# Altium project higgs.PrjPCB (part 6 of 7)

## Sheet cellular.SchDoc
size D; CompanyName: Signal Laboratories, Inc.; Address1: 3479 Edison Way; Address2: Menlo Park CA 94025; Address3: +1 (877) 778-8435; Address4: siglabs.com; Revision: 1; SheetNumber: 1; SheetTotal: 1
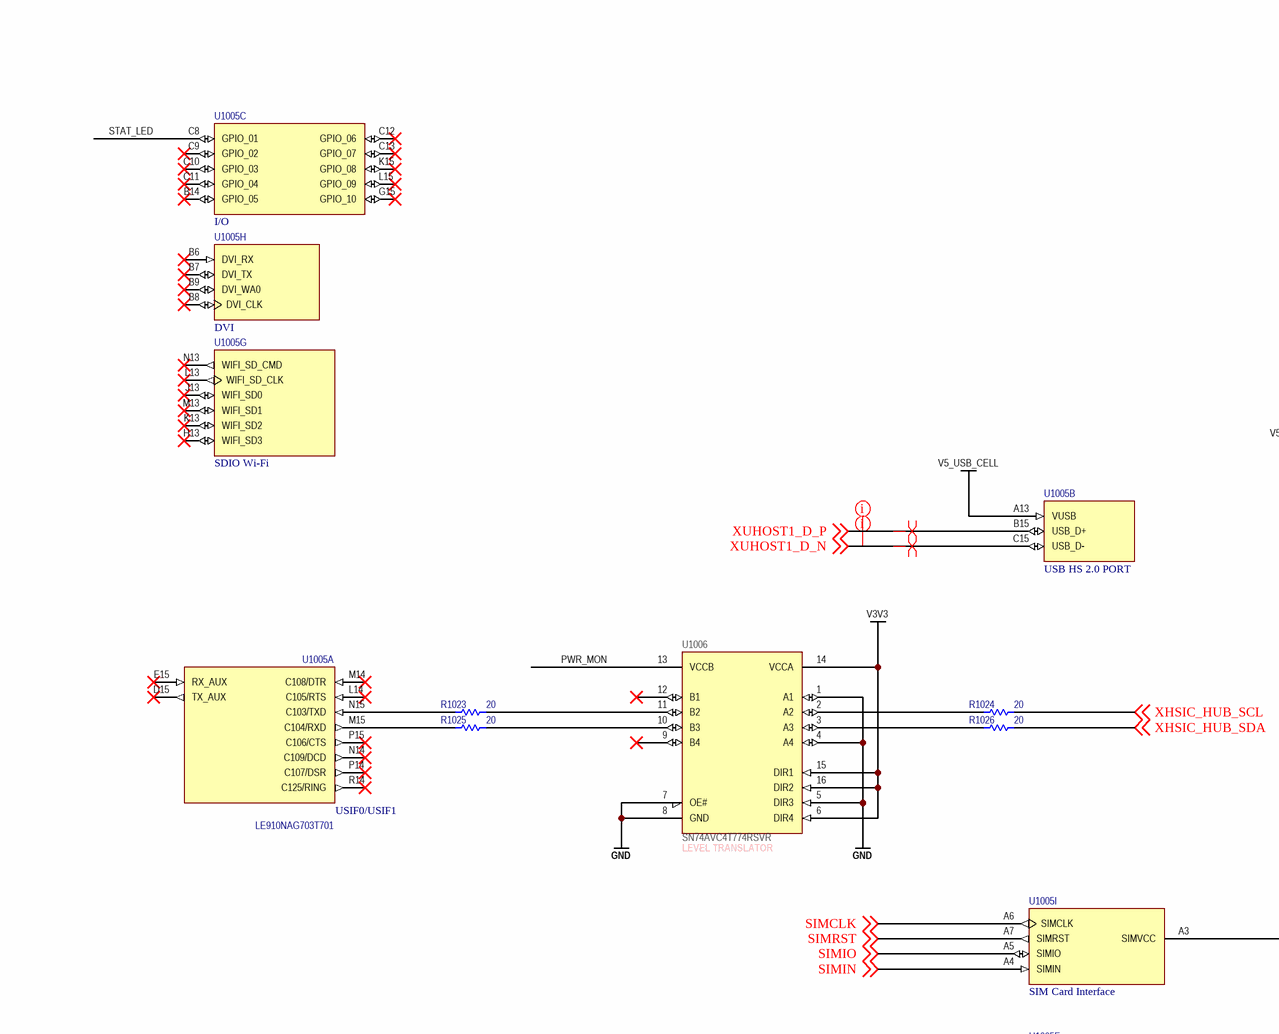
[diagram p36: cellular.SchDoc, top left]
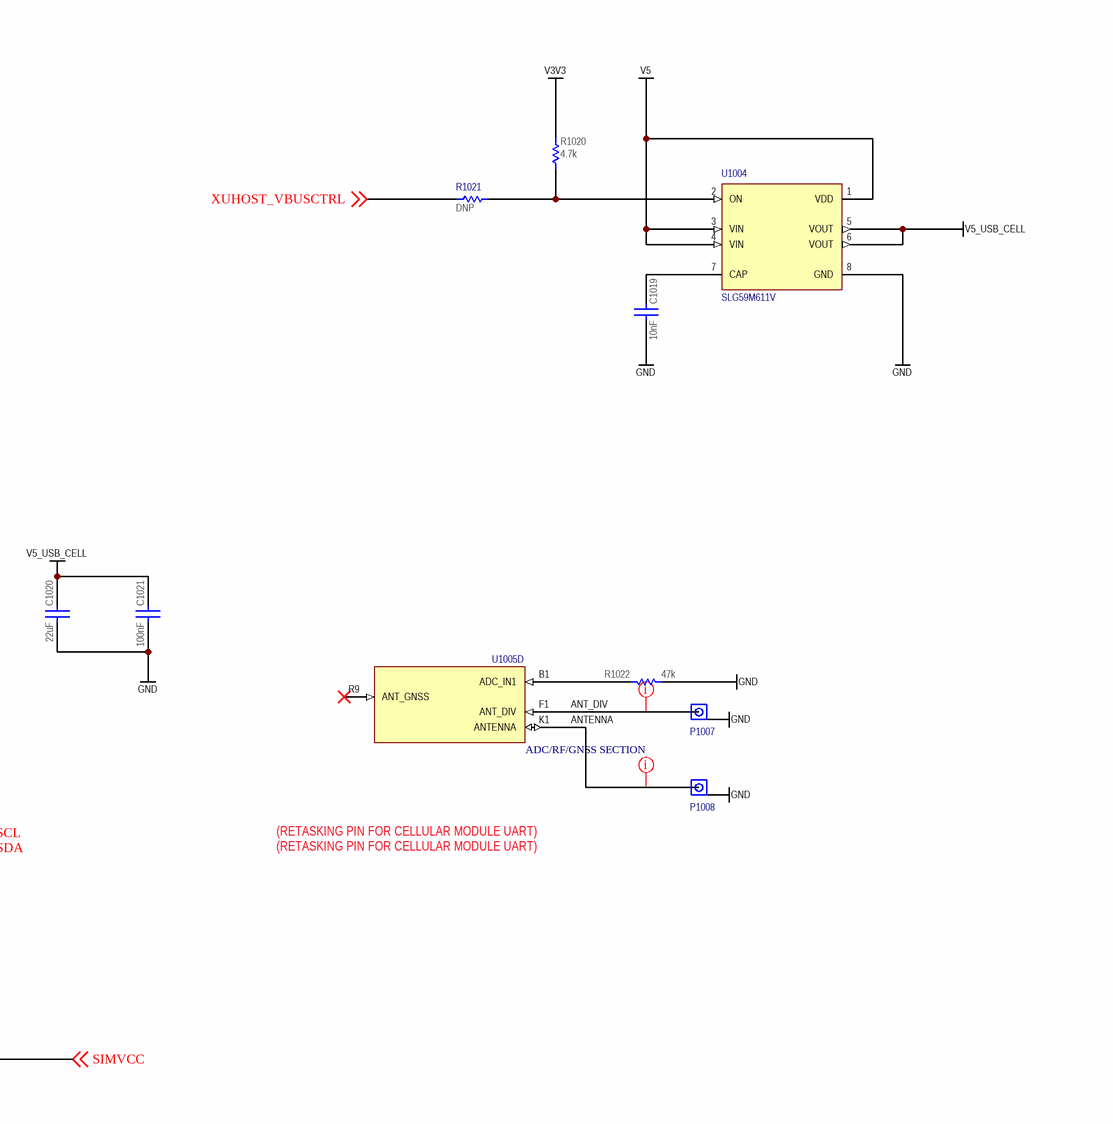
[diagram p37: cellular.SchDoc, top right]
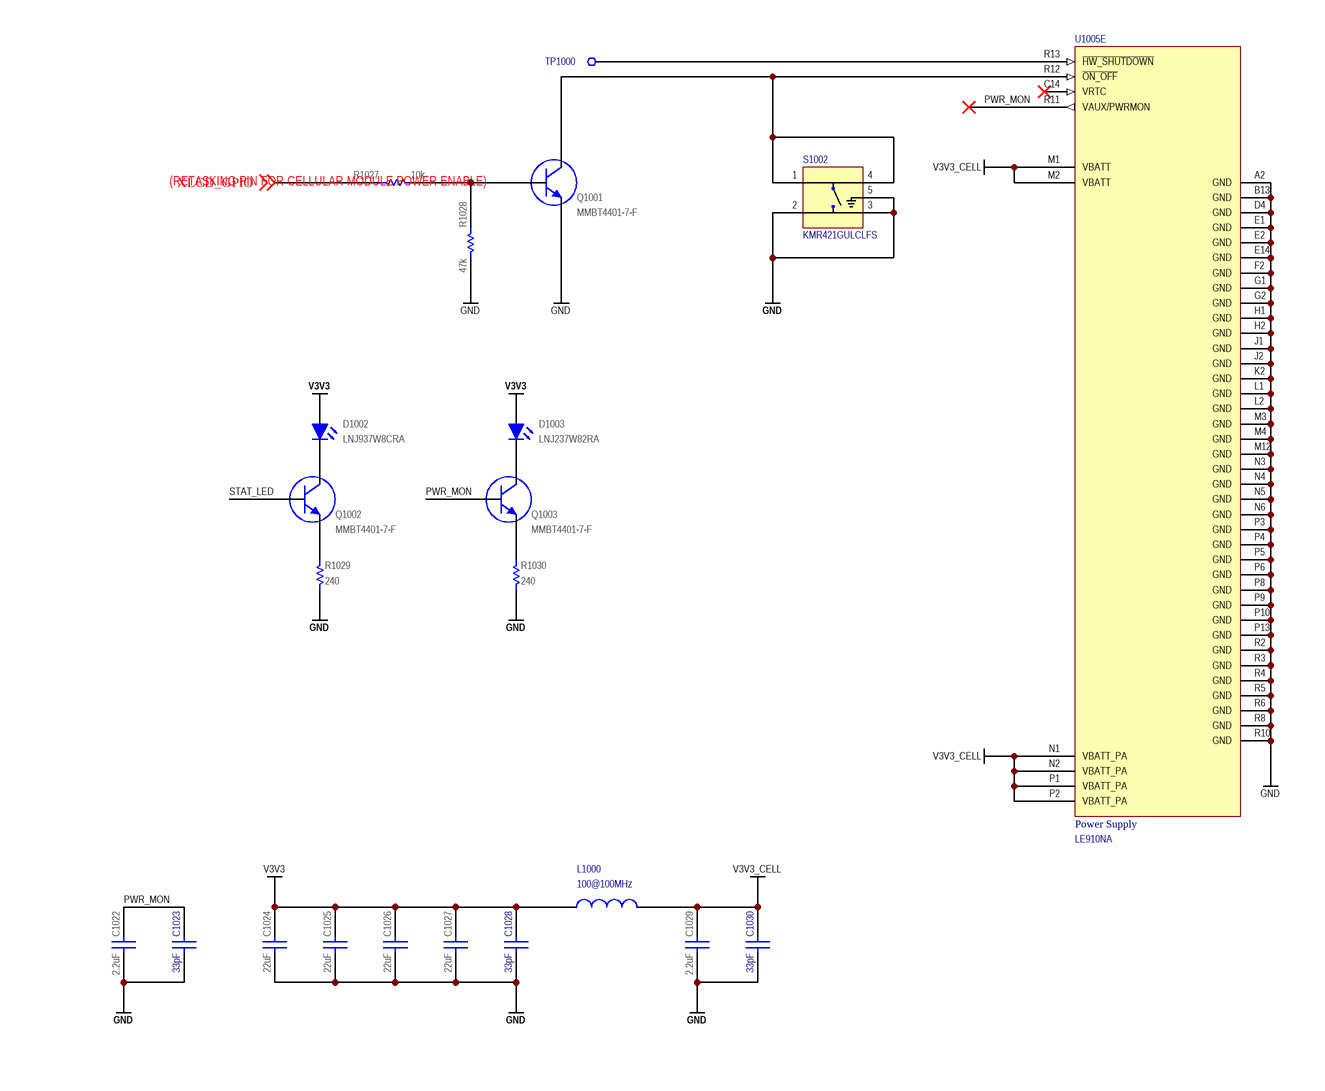
[diagram p38: cellular.SchDoc, bottom left]
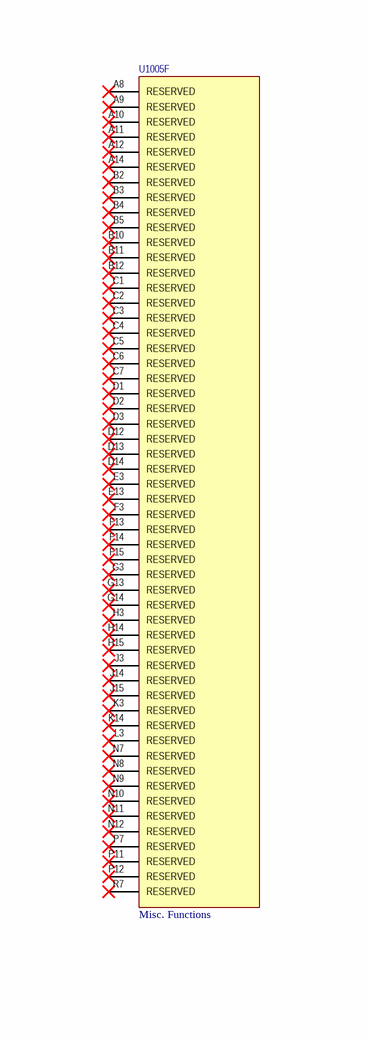
[diagram p39: cellular.SchDoc, bottom right]

### Parts
C1019  value 10nF  [CAPC100X50X55L25N]  (hidden comment: GCM155R71H103KA55)
C1020  value 22uF  [CAPC200X125X145L45N]  (hidden comment: C2012X7S1A226M125)
C1021  value 100nF  [CAPC100X50X55L25N]  (hidden comment: GCM155R71H104KE02)
C1022  value 2.2uF  [CAPC160X80X90L20N]  (hidden comment: C1608X7R1A225M080)
C1023  value 33pF  [0402]  (hidden comment: CBR04C330F5GAC)
C1024  value 22uF  [CAPC200X125X145L45N]  (hidden comment: C2012X7S1A226M125)
C1025  value 22uF  [CAPC200X125X145L45N]  (hidden comment: C2012X7S1A226M125)
C1026  value 22uF  [CAPC200X125X145L45N]  (hidden comment: C2012X7S1A226M125)
C1027  value 22uF  [CAPC200X125X145L45N]  (hidden comment: C2012X7S1A226M125)
C1028  value 33pF  [0402]  (hidden comment: CBR04C330F5GAC)
C1029  value 2.2uF  [CAPC160X80X90L20N]  (hidden comment: C1608X7R1A225M080)
C1030  value 33pF  [0402]  (hidden comment: CBR04C330F5GAC)
D1002  LNJ937W8CRA  [0603_LED]
D1003  LNJ237W82RA  [0603_LED]
L1000  value 100@100MHz  [0603]  (hidden comment: BLM15PX601SN1D)
P1007  U.FL-R-SMT(10)  [U.FL-R-SMT(10)]  (value not drawn)
P1008  U.FL-R-SMT(10)  [U.FL-R-SMT(10)]  (value not drawn)
Q1001  MMBT4401-7-F  [SOT23]
Q1002  MMBT4401-7-F  [SOT23]
Q1003  MMBT4401-7-F  [SOT23]
R1020  value 4.7k  [RESC1005X40N]  (hidden comment: ERJ-2RKF4701X)
R1021  Do Not Place: DNP  [0402]  (hidden comment: ERJ-2RKF20R0X)
R1022  value 47k  [RESC1005X40N]  (hidden comment: ERJ-2RKF4702X)
R1023  value 20  [0402]  (hidden comment: ERJ-2RKF20R0X)
R1024  value 20  [0402]  (hidden comment: ERJ-2RKF20R0X)
R1025  value 20  [0402]  (hidden comment: ERJ-2RKF20R0X)
R1026  value 20  [0402]  (hidden comment: ERJ-2RKF20R0X)
R1027  value 10k  [RESC1005X40N]  (hidden comment: ERJ-2RKF1002X)
R1028  value 47k  [RESC1005X40N]  (hidden comment: ERJ-2RKF4702X)
R1029  value 240  [RESC1005X40N]  (hidden comment: ERJ-2RKF2400X)
R1030  value 240  [RESC1005X40N]  (hidden comment: ERJ-2RKF2400X)
S1002  KMR421GULCLFS  [SW_KMR421GULCLFS]
TP1000  TEST_POINT_SMD_10  [TEST_POINT_SMD_10]  (value not drawn)  (no BOM)
U1004  SLG59M611V  [DFN200X150X80-8N]
U1005  LE910NAG703T701  [LGA144S180P15X15_2820X2820X225_LE910NAG703T701(Primary)]  (parts A,B,C,D,E,F,G,H,I of 9)
U1006  SN74AVC4T774RSVR  [RSV]

### Nets
GND: C1019.1 C1020.1 C1021.1 C1022.1 C1023.2 C1024.1 C1025.1 C1026.1 C1027.1 C1028.2 C1029.1 C1030.2 P1007.2(GND) P1008.2(GND) Q1001.2(E) R1022.1 R1028.1 R1029.2 R1030.2 S1002.2 S1002.3 S1002.5(G) U1004.8(GND) U1005.A2(GND) U1005.B13(GND) U1005.D4(GND) U1005.E1(GND) U1005.E2(GND) U1005.E14(GND) U1005.F2(GND) U1005.G1(GND) U1005.G2(GND) U1005.H1(GND) U1005.H2(GND) U1005.J1(GND) U1005.J2(GND) U1005.K2(GND) U1005.L1(GND) U1005.L2(GND) U1005.M3(GND) U1005.M4(GND) U1005.M12(GND) U1005.N3(GND) U1005.N4(GND) U1005.N5(GND) U1005.N6(GND) U1005.P3(GND) U1005.P4(GND) U1005.P5(GND) U1005.P6(GND) U1005.P8(GND) U1005.P9(GND) U1005.P10(GND) U1005.P13(GND) U1005.R2(GND) U1005.R3(GND) U1005.R4(GND) U1005.R5(GND) U1005.R6(GND) U1005.R8(GND) U1005.R10(GND) U1006.1(A1) U1006.4(A4) U1006.5(DIR3) U1006.7(OE#) U1006.8(GND)
V3V3: C1024.2 C1025.2 C1026.2 C1027.2 C1028.1 D1002.1(A) D1003.1(A) L1000.1 R1020.2 U1006.6(DIR4) U1006.14(VCCA) U1006.15(DIR1) U1006.16(DIR2)
V3V3_CELL: C1029.2 C1030.1 L1000.2 U1005.M1(VBATT) U1005.M2(VBATT) U1005.N1(VBATT_PA) U1005.N2(VBATT_PA) U1005.P1(VBATT_PA) U1005.P2(VBATT_PA)
V5: U1004.1(VDD) U1004.3(VIN) U1004.4(VIN)
V5_USB_CELL: C1020.2 C1021.2 U1004.5(VOUT) U1004.6(VOUT) U1005.A13(VUSB)
ANT_DIV: P1007.1(RF) U1005.F1(ANT_DIV)
ANTENNA: P1008.1(RF) U1005.K1(ANTENNA)
PWR_MON: C1022.2 C1023.1 Q1003.1(B) U1005.R11(VAUX/PWRMON) U1006.13(VCCB)
SIMCLK: U1005.A6(SIMCLK) ; off-sheet SIMCLK
SIMIN: U1005.A4(SIMIN) ; off-sheet SIMIN
SIMIO: U1005.A5(SIMIO) ; off-sheet SIMIO
SIMRST: U1005.A7(SIMRST) ; off-sheet SIMRST
SIMVCC: U1005.A3(SIMVCC) ; off-sheet SIMVCC
STAT_LED: Q1002.1(B) U1005.C8(GPIO_01)
XHSIC_HUB_SCL: R1024.1 ; off-sheet XHSIC_HUB_SCL
XHSIC_HUB_SDA: R1026.1 ; off-sheet XHSIC_HUB_SDA
XLCD_GPIO: R1027.2 ; off-sheet XLCD_GPIO
XUHOST1_D_N: U1005.C15(USB_D-) ; off-sheet XUHOST1_D_N
XUHOST1_D_P: U1005.B15(USB_D+) ; off-sheet XUHOST1_D_P
XUHOST_VBUSCTRL: R1021.2 ; off-sheet XUHOST_VBUSCTRL
NetC1019_2: C1019.2 U1004.7(CAP)
NetD1002_2: D1002.2(K) Q1002.3(C)
NetD1003_2: D1003.2(K) Q1003.3(C)
NetQ1001_1: Q1001.1(B) R1027.1 R1028.2
NetQ1001_3: Q1001.3(C) S1002.1 S1002.4 U1005.R12(~{ON_OFF})
NetQ1002_2: Q1002.2(E) R1029.1
NetQ1003_2: Q1003.2(E) R1030.1
NetR1020_1: R1020.1 R1021.1 U1004.2(ON)
NetR1022_2: R1022.2 U1005.B1(ADC_IN1)
NetR1023_1: R1023.1 U1006.11(B2)
NetR1023_2: R1023.2 U1005.N15(C103/TXD)
NetR1024_2: R1024.2 U1006.2(A2)
NetR1025_1: R1025.1 U1006.10(B3)
NetR1025_2: R1025.2 U1005.M15(C104/RXD)
NetR1026_2: R1026.2 U1006.3(A3)
NetTP1000_1: TP1000.1 U1005.R13(~{HW_SHUTDOWN})

Not connected (* = marked no-connect by the designer): U1005 A8(RESERVED)* A9(RESERVED)* A10(RESERVED)* A11(RESERVED)* A12(RESERVED)* A14(RESERVED)* B2(RESERVED)* B3(RESERVED)* B4(RESERVED)* B5(RESERVED)* B6(DVI_RX)* B7(DVI_TX)* B8(DVI_CLK)* B9(DVI_WA0)* B10(RESERVED)* B11(RESERVED)* B12(RESERVED)* B14(GPIO_05)* C1(RESERVED)* C2(RESERVED)* C3(RESERVED)* C4(RESERVED)* C5(RESERVED)* C6(RESERVED)* C7(RESERVED)* C9(GPIO_02)* C10(GPIO_03)* C11(GPIO_04)* C12(GPIO_06)* C13(GPIO_07)* C14(VRTC)* D1(RESERVED)* D2(RESERVED)* D3(RESERVED)* D12(RESERVED)* D13(RESERVED)* D14(RESERVED)* D15(TX_AUX)* E3(RESERVED)* E13(RESERVED)* E15(RX_AUX)* F3(RESERVED)* F13(RESERVED)* F14(RESERVED)* F15(RESERVED)* G3(RESERVED)* G13(RESERVED)* G14(RESERVED)* G15(GPIO_10)* H3(RESERVED)* H13(WIFI_SD3)* H14(RESERVED)* H15(RESERVED)* J3(RESERVED)* J13(WIFI_SD0)* J14(RESERVED)* J15(RESERVED)* K3(RESERVED)* K13(WIFI_SD2)* K14(RESERVED)* K15(GPIO_08)* L3(RESERVED)* L13(WIFI_SD_CLK)* L14(C105/RTS)* L15(GPIO_09)* M13(WIFI_SD1)* M14(C108/DTR)* N7(RESERVED)* N8(RESERVED)* N9(RESERVED)* N10(RESERVED)* N11(RESERVED)* N12(RESERVED)* N13(WIFI_SD_CMD)* N14(C109/DCD)* P7(RESERVED)* P11(RESERVED)* P12(RESERVED)* P14(C107/DSR)* P15(C106/CTS)* R7(RESERVED)* R9(ANT_GNSS)* R14(C125/RING)*; U1006 9(B4)* 12(B1)*

### Layout directives
net class RF: ANT_DIV, ANTENNA
net class USB: XUHOST1_D_N, XUHOST1_D_P
differential pair: XUHOST1_D_N, XUHOST1_D_P

### Notes on the sheet
- (RETASKING PIN FOR CELLULAR MODULE UART)
- (near U1006) LEVEL TRANSLATOR
- (RETASKING PIN FOR CELLULAR MODULE POWER ENABLE)
- Title
- Engineer
- Revision
- Drawn By
- Sheet
- of
- Checked By
- Date
- (in symbol LE910NAG703T701, part A) USIF0/USIF1
- (in symbol LE910NAG703T701, part B) USB HS 2.0 PORT
- (in symbol LE910NAG703T701, part C) I/O
- (in symbol LE910NAG703T701, part D) ADC/RF/GNSS SECTION
- (in symbol LE910NAG703T701, part E) Power Supply
- (in symbol LE910NAG703T701, part F) Misc. Functions
- (in symbol LE910NAG703T701, part G) SDIO Wi-Fi
- (in symbol LE910NAG703T701, part H) DVI
- (in symbol LE910NAG703T701, part I) SIM Card Interface

### Library data of the parts
C1019 = CAP: Ceramic Capacitor 10nF ±10% 50V X7R 0402; Manufacturer: Murata; Tr: -55:125; Manufacturer P/N: GCM155R71H103KA55; Tolerance: ±10%; Voltage: 50V; Footprint: *; Package: 0402
C1020 C1024-C1027 = CAP: Ceramic Capacitor 22uF ±20% 10V X7S 0805; Manufacturer: TDK; Tr: -55:125; Manufacturer P/N: C2012X7S1A226M125; Tolerance: ±20%; Voltage: 10V; Package: 0805
C1021 = CAP: Ceramic Capacitor 100nF ±10% 50V X7R 0402; Manufacturer: Murata; Tr: -55:125; Manufacturer P/N: GCM155R71H104KE02; Tolerance: ±10%; Voltage: 50V; Footprint: *; Package: 0402
C1022 C1029 = CAP: Ceramic Capacitor 2.2uF ±20% 10V X7R 0603; Manufacturer: TDK; Tr: -55:125; Manufacturer P/N: C1608X7R1A225M080; Tolerance: ±20%; Voltage: 10V; Footprint: *; Package: 0603
C1023 C1028 C1030 = CAP 0603: Ceramic Capacitor 33pF ±1% 50V NP0 0402; Manufacturer: Kemet; Tr: -55:125; Voltage: 50V; Manufacturer P/N: CBR04C330F5GAC; Package: 0402; Do Not Place: *; Tolerance: ±1%
D1002 = LED0603GR: LED, SMT 0603, Color Blue, 5mA, 2.9V; Manufacturer: Panasonic; Manufacturer P/N: LNJ937W8CRA; Package: 0603 Polarized
D1003 = LED0603RD: LED, SMT 0603, Color Red, 5mA, 1.85V; Manufacturer: Panasonic; Manufacturer P/N: LNJ237W82RA; Package: 0603 Polarized
L1000 = IND 0402: Ferrite Bead 100-Ohm @ 100MHz 2A 0603; Manufacturer: Murata; Manufacturer P/N: BLM18EG101TN1; Tolerance: ±25%; Tr: -55:125; Package: 0603
P1007 P1008 = U.FL-R-SMT(10): Ultra Miniature Coaxial Jack, 50 Ohms; Manufacturer: Hirose; Manufacturer P/N: U.FL-R-SMT(10)
Q1001-Q1003 = MMBT4401-7-F: NPN Small Signal Transistor SMD SOT-23; Manufacturer: Diodes, Inc.; Manufacturer P/N: MMBT4401-7-F
R1020 = RES: Thick Film Resistor 4.7k ±1% 0.1W 75V 0402; Manufacturer: Panasonic; Tcr: ±100; Tr: -55:155; Voltage: 75; Power: 0.1; Tolerance: ±1%; Manufacturer P/N: ERJ-2RKF4701X; Alternatives: *; Footprint: *; Package: 0402
R1021 = RES 0402: Thick Film Resistor 20 ±1% 0402; Manufacturer: Panasonic; Manufacturer P/N: RC0402FR-0720L; Value: 20; Tr: -55:155; Package: 0402; Tolerance: ±1%
R1022 R1028 = RES: Thick Film Resistor 47k ±1% 0.1W 75V 0402; Manufacturer: Panasonic; Tcr: ±100; Tr: -55:155; Voltage: 75; Power: 0.1; Tolerance: ±1%; Manufacturer P/N: ERJ-2RKF4702X; Alternatives: *; Footprint: *; Package: 0402
R1023-R1026 = RES 0402: Thick Film Resistor 20 ±1% 0402; Manufacturer: Panasonic; Manufacturer P/N: RC0402FR-0720L; Tr: -55:155; Package: 0402; Tolerance: ±1%
R1027 = RES: Thick Film Resistor 10k ±1% 0.1W 0402; Manufacturer: Panasonic; Tcr: ±100; Tr: -55:155; Voltage: 75; Power: 0.1; Tolerance: ±1%; Manufacturer P/N: ERJ-2RKF1002X; Alternatives: *; Footprint: *; Package: 0402
R1029 R1030 = RES: Thick Film Resistor 240 ±1% 0.1W 75V 0402; Manufacturer: Panasonic; Tcr: ±100; Tr: -55:155; Voltage: 75; Power: 0.1; Tolerance: ±1%; Manufacturer P/N: ERJ-2RKF2400X; Alternatives: *; Footprint: *; Package: 0402
S1002 = KMR421GULCLFS: Switch Tactile N.O. SPST Round Button Gull Wing 0.05A 32VDC 1VA 200000Cycles 2N SMD Automotive T/R; Manufacturer: C&K Components; Availability: Good; Package: None; Manufacturer P/N: KMR421GULCLFS; Price: 0.29 USD; Value: *
TP1000 = TEST_POINT_SMD_10: Test Point SMD
U1004 = SLG59M611V: High-Side Load Switch; Manufacturer: Silego; Package: WFDFN-8 Silego; Manufacturer P/N: SLG59M611V
U1005 = LE910NAG703T701: Manufacturer: Telit; Manufacturer P/N: LE910NAG703T701
U1006 = SN74AVC4T774RSVR: 4-Bit Dual-Supply Bus Transceiver; Manufacturer: Texas Instruments; Manufacturer P/N: SN74AVC4T774RSVR

## Sheet radio.SchDoc
size Letter; CompanyName: Signal Laboratories, Inc.; Address1: 3479 Edison Way; Address2: Menlo Park CA 94025; Address3: +1 (877) 778-8435; Address4: siglabs.com; Revision: 1; SheetNumber: 1; SheetTotal: 1
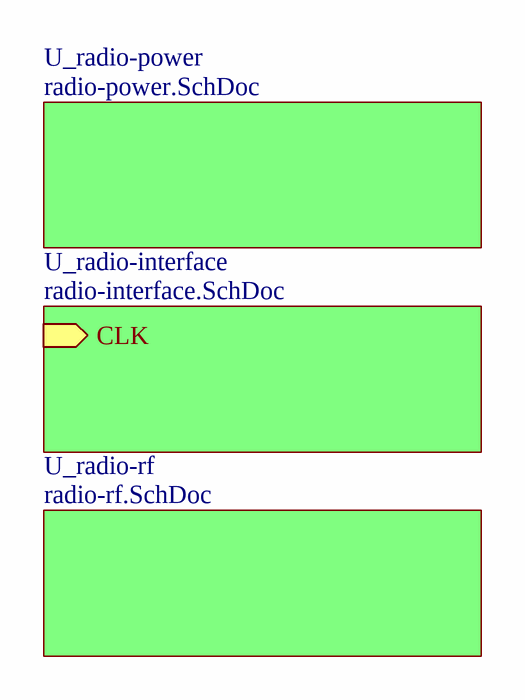
[diagram p40: radio.SchDoc]

### Sub-sheets
U_radio-interface = radio-interface.SchDoc: CLK (in)
U_radio-power = radio-power.SchDoc: no entries
U_radio-rf = radio-rf.SchDoc: no entries

### Notes on the sheet
- Title
- Engineer
- Revision
- Drawn By
- Checked By
- Date
- Sheet
- of

## Sheet radio-power.SchDoc
size Letter; CompanyName: Signal Laboratories, Inc.; Address1: 3479 Edison Way; Address2: Menlo Park CA 94025; Address3: +1 (877) 778-8435; Address4: siglabs.com; Revision: 1; SheetNumber: 1; SheetTotal: 1
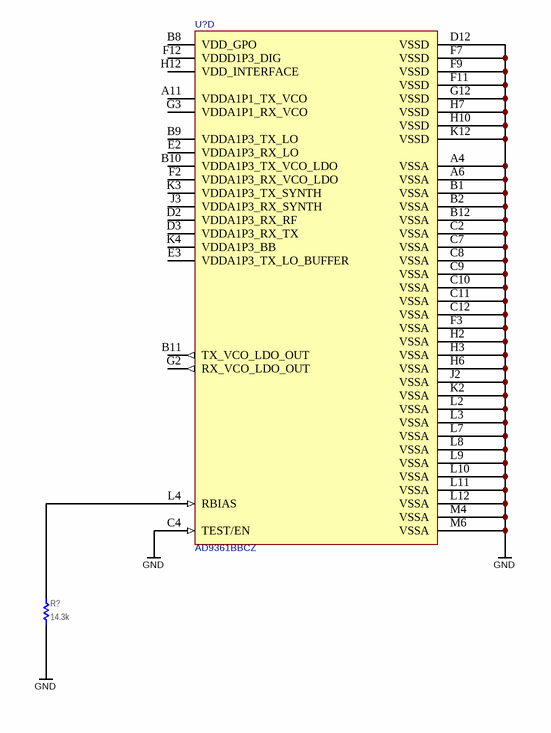
[diagram p41: radio-power.SchDoc]

### Parts
R?  value 14.3k  [RESC1005X40N]  (hidden comment: ERJ-2RKF1432X)
U?  AD9361BBCZ  [BGA144C80P12X12_1000X1000X170_AD9361BBCZ(Primary)]  (part D of 4)

### Nets
GND: R?.2 U?.A4(VSSA) U?.A6(VSSA) U?.B1(VSSA) U?.B2(VSSA) U?.B12(VSSA) U?.C2(VSSA) U?.C4(TEST/EN) U?.C7(VSSA) U?.C8(VSSA) U?.C9(VSSA) U?.C10(VSSA) U?.C11(VSSA) U?.C12(VSSA) U?.D12(VSSD) U?.F3(VSSA) U?.F7(VSSD) U?.F9(VSSD) U?.F11(VSSD) U?.G12(VSSD) U?.H2(VSSA) U?.H3(VSSA) U?.H6(VSSA) U?.H7(VSSD) U?.H10(VSSD) U?.J2(VSSA) U?.K2(VSSA) U?.K12(VSSD) U?.L2(VSSA) U?.L3(VSSA) U?.L7(VSSA) U?.L8(VSSA) U?.L9(VSSA) U?.L10(VSSA) U?.L11(VSSA) U?.L12(VSSA) U?.M4(VSSA) U?.M6(VSSA)
NetR?_1: R?.1 U?.L4(RBIAS)

Not connected (* = marked no-connect by the designer): U? A11(VDDA1P1_TX_VCO) B8(VDD_GPO) B9(VDDA1P3_TX_LO) B10(VDDA1P3_TX_VCO_LDO) B11(TX_VCO_LDO_OUT) D2(VDDA1P3_RX_RF) D3(VDDA1P3_RX_TX) E2(VDDA1P3_RX_LO) E3(VDDA1P3_TX_LO_BUFFER) F2(VDDA1P3_RX_VCO_LDO) F12(VDDD1P3_DIG) G2(RX_VCO_LDO_OUT) G3(VDDA1P1_RX_VCO) H12(VDD_INTERFACE) J3(VDDA1P3_RX_SYNTH) K3(VDDA1P3_TX_SYNTH) K4(VDDA1P3_BB)

### Notes on the sheet
- Title
- Engineer
- Revision
- Drawn By
- Checked By
- Date
- Sheet
- of

### Library data of the parts
R? = RES: Thick Film Resistor 14.3k ±1% 0.1W 75V 0402; Manufacturer: Panasonic; Tcr: ±100; Tr: -55:155; Voltage: 75; Power: 0.1; Tolerance: ±1%; Manufacturer P/N: ERJ-2RKF1432X; Alternatives: *; Footprint: *; Package: 0402
U? = AD9361: RF Agile Transceiver

## Sheet radio-interface.SchDoc
size Letter; CompanyName: Signal Laboratories, Inc.; Address1: 3479 Edison Way; Address2: Menlo Park CA 94025; Address3: +1 (877) 778-8435; Address4: siglabs.com; Revision: 1; SheetNumber: 1; SheetTotal: 1
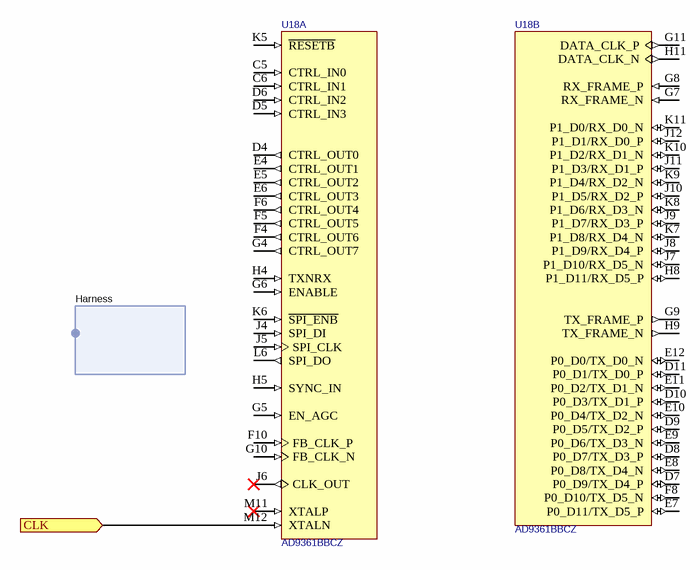
[diagram p42: radio-interface.SchDoc]

### Parts
U18  AD9361BBCZ  [BGA144C80P12X12_1000X1000X170_AD9361BBCZ(Primary)]  (parts A,B of 4)

### Ports
CLK (in)

### Harnesses
Harness: 

### Nets
CLK: U18.M12(XTALN) ; port CLK

Not connected (* = marked no-connect by the designer): U18 C5(CTRL_IN0) C6(CTRL_IN1) D4(CTRL_OUT0) D5(CTRL_IN3) D6(CTRL_IN2) D7(P0_D9/TX_D4_P) D8(P0_D7/TX_D3_P) D9(P0_D5/TX_D2_P) D10(P0_D3/TX_D1_P) D11(P0_D1/TX_D0_P) E4(CTRL_OUT1) E5(CTRL_OUT2) E6(CTRL_OUT3) E7(P0_D11/TX_D5_P) E8(P0_D8/TX_D4_N) E9(P0_D6/TX_D3_N) E10(P0_D4/TX_D2_N) E11(P0_D2/TX_D1_N) E12(P0_D0/TX_D0_N) F4(CTRL_OUT6) F5(CTRL_OUT5) F6(CTRL_OUT4) F8(P0_D10/TX_D5_N) F10(FB_CLK_P) G4(CTRL_OUT7) G5(EN_AGC) G6(ENABLE) G7(RX_FRAME_N) G8(RX_FRAME_P) G9(TX_FRAME_P) G10(FB_CLK_N) G11(DATA_CLK_P) H4(TXNRX) H5(SYNC_IN) H8(P1_D11/RX_D5_P) H9(TX_FRAME_N) H11(DATA_CLK_N) J4(SPI_DI) J5(SPI_CLK) J6(CLK_OUT)* J7(P1_D10/RX_D5_N) J8(P1_D9/RX_D4_P) J9(P1_D7/RX_D3_P) J10(P1_D5/RX_D2_P) J11(P1_D3/RX_D1_P) J12(P1_D1/RX_D0_P) K5(~{RESETB}) K6(~{SPI_ENB}) K7(P1_D8/RX_D4_N) K8(P1_D6/RX_D3_N) K9(P1_D4/RX_D2_N) K10(P1_D2/RX_D1_N) K11(P1_D0/RX_D0_N) L6(SPI_DO) M11(XTALP)*

### Notes on the sheet
- Title
- Engineer
- Revision
- Drawn By
- Checked By
- Date
- Sheet
- of

### Library data of the parts
U18 = AD9361: RF Agile Transceiver

## Sheet radio-rf.SchDoc
size Letter; CompanyName: Signal Laboratories, Inc.; Address1: 3479 Edison Way; Address2: Menlo Park CA 94025; Address3: +1 (877) 778-8435; Address4: siglabs.com; Revision: 1; SheetNumber: 1; SheetTotal: 1
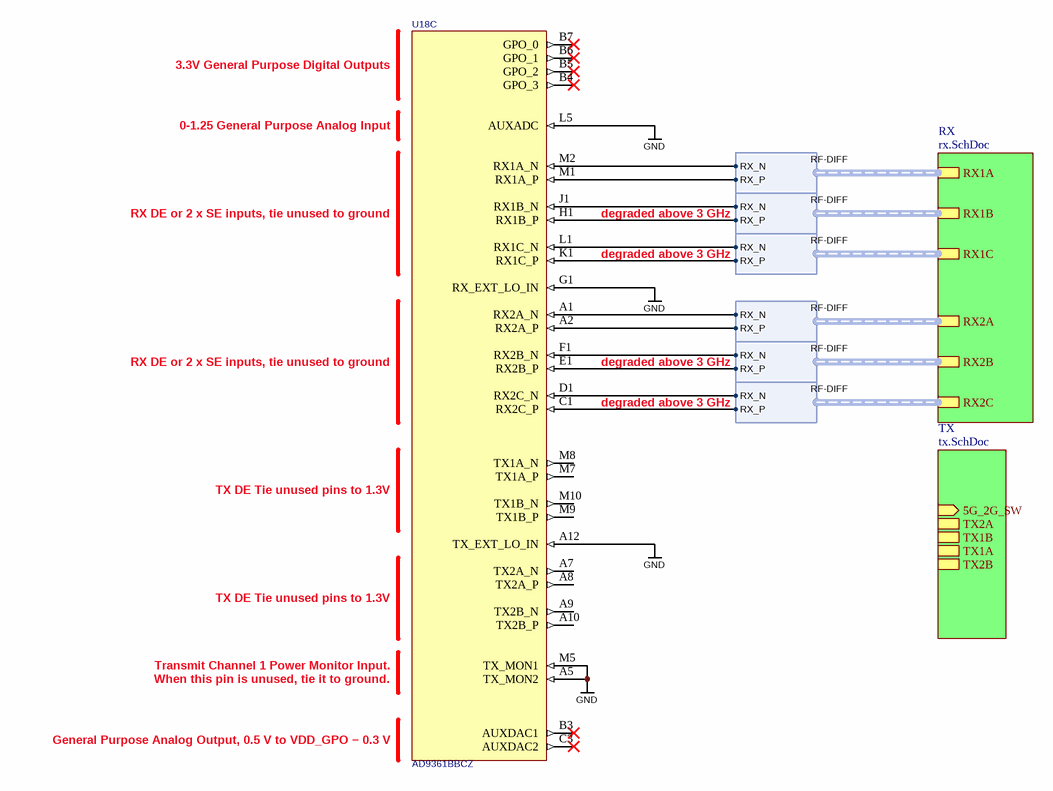
[diagram p43: radio-rf.SchDoc]

### Parts
U18  AD9361BBCZ  [BGA144C80P12X12_1000X1000X170_AD9361BBCZ(Primary)]  (part C of 4)

### Sub-sheets
RX = rx.SchDoc: RX1A (harness RF-DIFF), RX1B (harness RF-DIFF), RX1C (harness RF-DIFF), RX2A (harness RF-DIFF), RX2B (harness RF-DIFF), RX2C (harness RF-DIFF)
TX = tx.SchDoc: 5G_2G_SW (in), TX2A (harness RF-DIFF), TX1B (harness RF-DIFF), TX1A (harness RF-DIFF), TX2B (harness RF-DIFF)

### Harnesses
RF-DIFF: RX_N, RX_P

### Nets
GND: U18.A5(TX_MON2) U18.A12(TX_EXT_LO_IN) U18.G1(RX_EXT_LO_IN) U18.L5(AUXADC) U18.M5(TX_MON1)
NetC153_1: U18.M2(RX1A_N) ; sheet RX/RX1A.RX_N
NetC154_1: U18.M1(RX1A_P) ; sheet RX/RX1A.RX_P
NetC155_1: U18.J1(RX1B_N) ; sheet RX/RX1B.RX_N
NetC156_1: U18.H1(RX1B_P) ; sheet RX/RX1B.RX_P
NetC157_1: U18.L1(RX1C_N) ; sheet RX/RX1C.RX_N
NetC169_1: U18.K1(RX1C_P) ; sheet RX/RX1C.RX_P
NetC170_1: U18.A1(RX2A_N) ; sheet RX/RX2A.RX_N
NetC171_1: U18.A2(RX2A_P) ; sheet RX/RX2A.RX_P
NetC172_1: U18.F1(RX2B_N) ; sheet RX/RX2B.RX_N
NetC173_1: U18.E1(RX2B_P) ; sheet RX/RX2B.RX_P
NetC174_1: U18.D1(RX2C_N) ; sheet RX/RX2C.RX_N
NetC175_1: U18.C1(RX2C_P) ; sheet RX/RX2C.RX_P

Not connected (* = marked no-connect by the designer): U18 A7(TX2A_N) A8(TX2A_P) A9(TX2B_N) A10(TX2B_P) B3(AUXDAC1)* B4(GPO_3)* B5(GPO_2)* B6(GPO_1)* B7(GPO_0)* C3(AUXDAC2)* M7(TX1A_P) M8(TX1A_N) M9(TX1B_P) M10(TX1B_N)

### Notes on the sheet
- 3.3V General Purpose Digital Outputs
- 0-1.25 General Purpose Analog Input
- RX DE or 2 x SE inputs, tie unused to ground
- degraded above 3 GHz
- TX DE Tie unused pins to 1.3V
- Transmit Channel 1 Power Monitor Input.
- General Purpose Analog Output, 0.5 V to VDD_GPO − 0.3 V
- When this pin is unused, tie it to ground.
- Title
- Engineer
- Revision
- Drawn By
- Checked By
- Date
- Sheet
- of

### Library data of the parts
U18 = AD9361: RF Agile Transceiver

## Sheet tx.SchDoc
size Legal; CompanyName: Signal Laboratories, Inc.; Address1: 3479 Edison Way; Address2: Menlo Park CA 94025; Address3: +1 (877) 778-8435; Address4: siglabs.com; Revision: 1; SheetNumber: 1; SheetTotal: 1
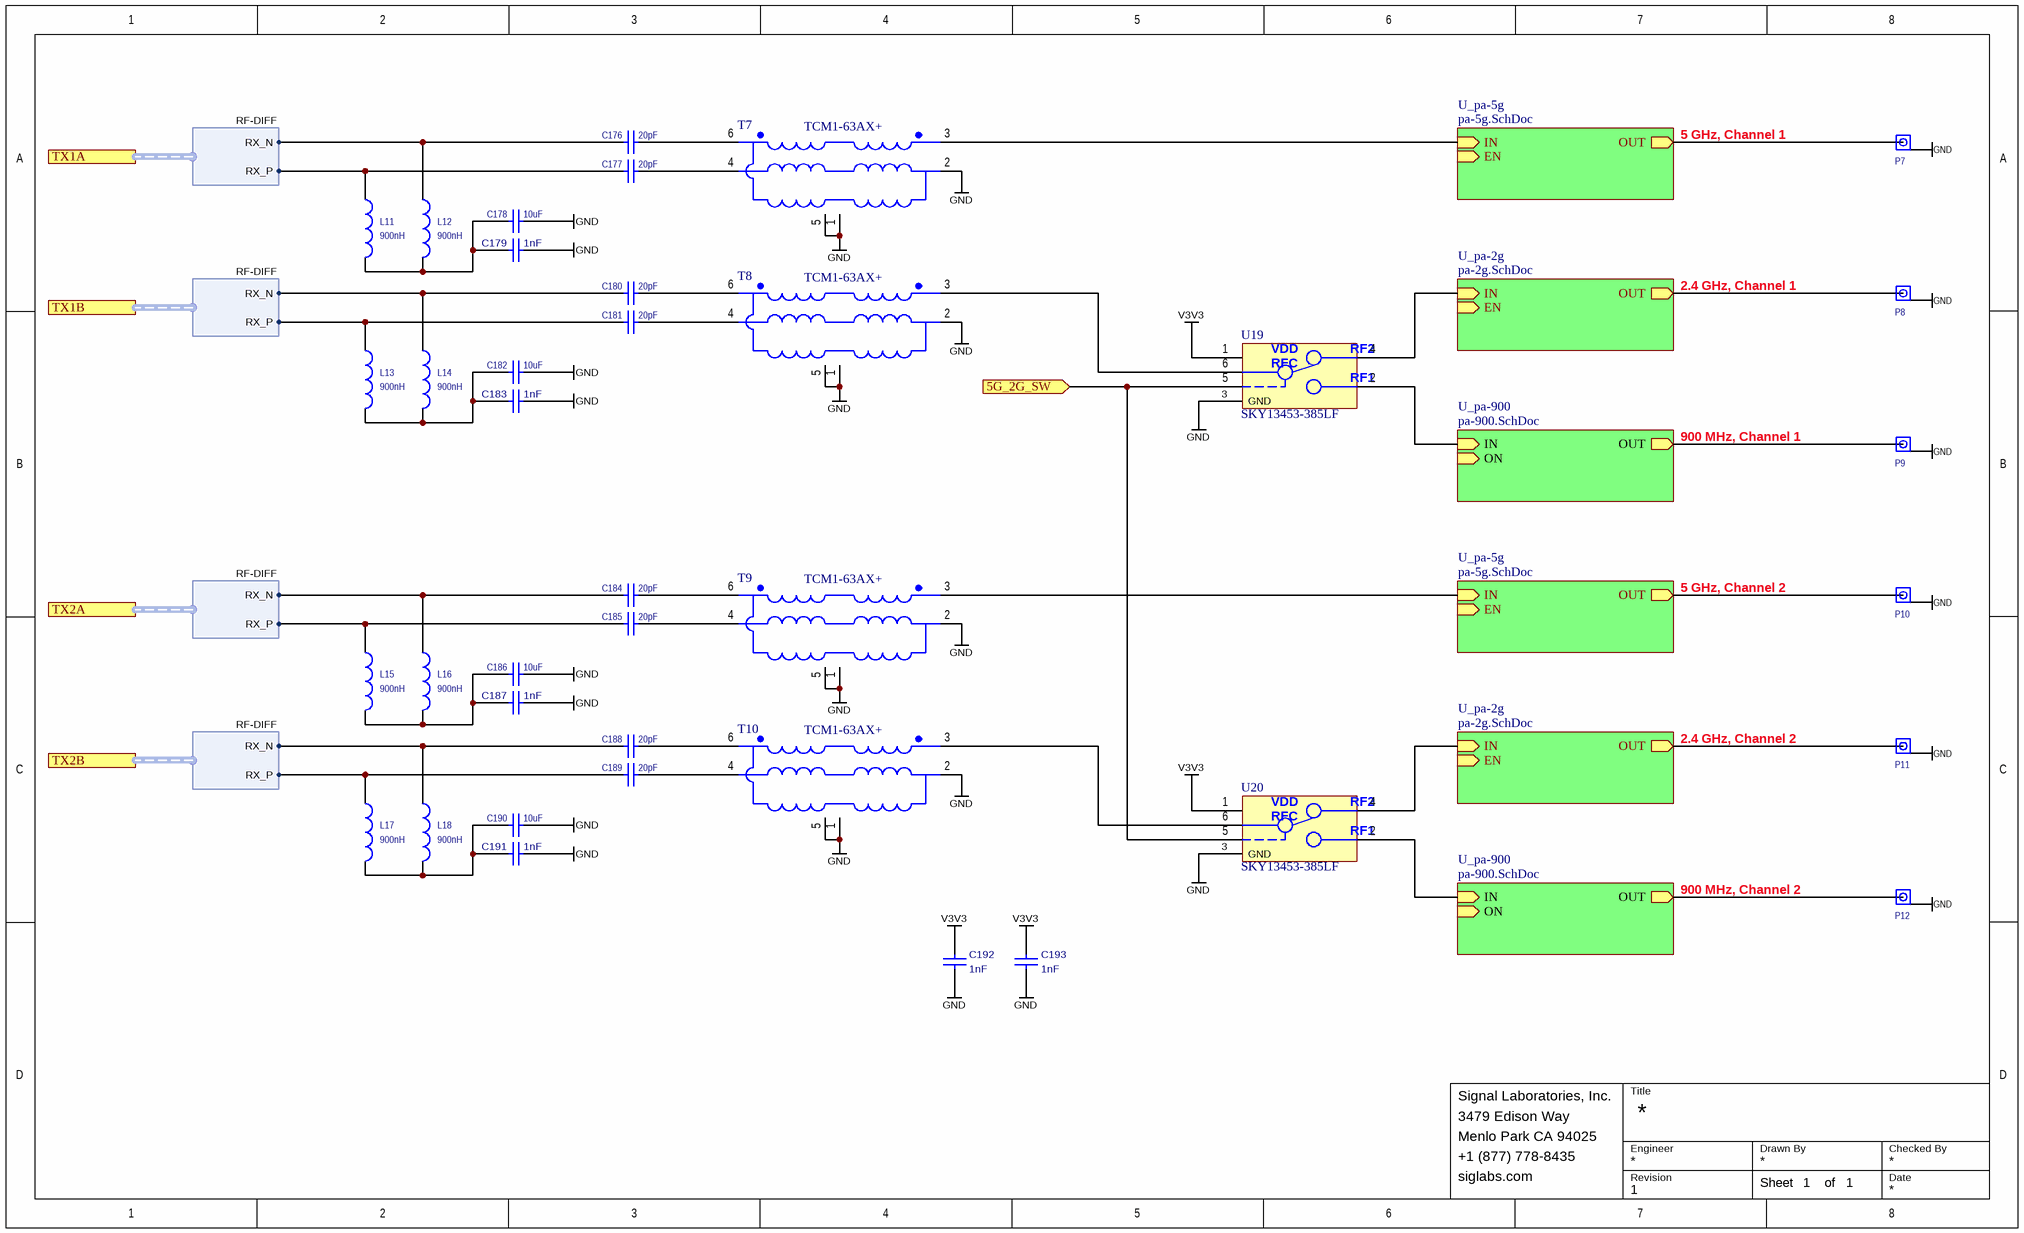
[diagram p44: tx.SchDoc]

### Parts
C176  value 20pF  [0402]  (hidden comment: CBR04C200F5GAC)
C177  value 20pF  [0402]  (hidden comment: CBR04C200F5GAC)
C178  value 10uF  [0603]  (hidden comment: CL10A106MA8NRNC)
C179  value 1nF  [CAPC160X80X90L20N]  (hidden comment: VJ0402Y102KXA)
C180  value 20pF  [0402]  (hidden comment: CBR04C200F5GAC)
C181  value 20pF  [0402]  (hidden comment: CBR04C200F5GAC)
C182  value 10uF  [0603]  (hidden comment: CL10A106MA8NRNC)
C183  value 1nF  [CAPC160X80X90L20N]  (hidden comment: VJ0402Y102KXA)
C184  value 20pF  [0402]  (hidden comment: CBR04C200F5GAC)
C185  value 20pF  [0402]  (hidden comment: CBR04C200F5GAC)
C186  value 10uF  [0603]  (hidden comment: CL10A106MA8NRNC)
C187  value 1nF  [CAPC160X80X90L20N]  (hidden comment: VJ0402Y102KXA)
C188  value 20pF  [0402]  (hidden comment: CBR04C200F5GAC)
C189  value 20pF  [0402]  (hidden comment: CBR04C200F5GAC)
C190  value 10uF  [0603]  (hidden comment: CL10A106MA8NRNC)
C191  value 1nF  [CAPC160X80X90L20N]  (hidden comment: VJ0402Y102KXA)
C192  value 1nF  [CAPC160X80X90L20N]  (hidden comment: VJ0402Y102KXA)
C193  value 1nF  [CAPC160X80X90L20N]  (hidden comment: VJ0402Y102KXA)
L11  value 900nH  [COILCRAFT_1008AF]  (hidden comment: 1008AF-901XJLC)
L12  value 900nH  [COILCRAFT_1008AF]  (hidden comment: 1008AF-901XJLC)
L13  value 900nH  [COILCRAFT_1008AF]  (hidden comment: 1008AF-901XJLC)
L14  value 900nH  [COILCRAFT_1008AF]  (hidden comment: 1008AF-901XJLC)
L15  value 900nH  [COILCRAFT_1008AF]  (hidden comment: 1008AF-901XJLC)
L16  value 900nH  [COILCRAFT_1008AF]  (hidden comment: 1008AF-901XJLC)
L17  value 900nH  [COILCRAFT_1008AF]  (hidden comment: 1008AF-901XJLC)
L18  value 900nH  [COILCRAFT_1008AF]  (hidden comment: 1008AF-901XJLC)
P7  U.FL-R-SMT(10)  [U.FL-R-SMT(10)]  (value not drawn)
P8  U.FL-R-SMT(10)  [U.FL-R-SMT(10)]  (value not drawn)
P9  U.FL-R-SMT(10)  [U.FL-R-SMT(10)]  (value not drawn)
P10  U.FL-R-SMT(10)  [U.FL-R-SMT(10)]  (value not drawn)
P11  U.FL-R-SMT(10)  [U.FL-R-SMT(10)]  (value not drawn)
P12  U.FL-R-SMT(10)  [U.FL-R-SMT(10)]  (value not drawn)
T7  TCM1-63AX+  [TCM1-63AX+]
T8  TCM1-63AX+  [TCM1-63AX+]
T9  TCM1-63AX+  [TCM1-63AX+]
T10  TCM1-63AX+  [TCM1-63AX+]
U19  SKY13453-385LF  [SKY13453-385LF]
U20  SKY13453-385LF  [SKY13453-385LF]

### Sub-sheets
U_pa-2g = pa-2g.SchDoc: OUT (out), IN (in), EN (in)
U_pa-2g = pa-2g.SchDoc: OUT (out), IN (in), EN (in)
U_pa-5g = pa-5g.SchDoc: OUT (out), IN (in), EN (in)
U_pa-5g = pa-5g.SchDoc: OUT (out), IN (in), EN (in)
U_pa-900 = pa-900.SchDoc (file not in this document): IN (in), OUT (out), ON (in)
U_pa-900 = pa-900.SchDoc (file not in this document): IN (in), OUT (out), ON (in)

### Ports
5G_2G_SW (in), TX1A (harness RF-DIFF), TX1B (harness RF-DIFF), TX2A (harness RF-DIFF), TX2B (harness RF-DIFF)

### Harnesses
RF-DIFF: RX_N, RX_P

### Nets
GND: C178.1 C179.2 C182.1 C183.2 C186.1 C187.2 C190.1 C191.2 C192.1 C193.1 P7.2(GND) P8.2(GND) P9.2(GND) P10.2(GND) P11.2(GND) P12.2(GND) T7.1 T7.2 T7.5 T8.1 T8.2 T8.5 T9.1 T9.2 T9.5 T10.1 T10.2 T10.5 U19.3(GND) U20.3(GND)
V3V3: C192.2 C193.2 U19.1(VDD) U20.1(VDD)
5G_2G_SW: U19.5(CTL) U20.5(CTL) ; port 5G_2G_SW
IN: T7.3 ; sheet U_pa-5g/IN
IN: T9.3 ; sheet U_pa-5g/IN  [a separate net that carries the same name]
IN: U19.4(RF2) ; sheet U_pa-2g/IN  [a separate net that carries the same name]
IN: U20.4(RF2) ; sheet U_pa-2g/IN  [a separate net that carries the same name]
OUT: P7.1(RF) ; sheet U_pa-5g/OUT
OUT: P8.1(RF) ; sheet U_pa-2g/OUT  [a separate net that carries the same name]
OUT: P10.1(RF) ; sheet U_pa-5g/OUT  [a separate net that carries the same name]
OUT: P11.1(RF) ; sheet U_pa-2g/OUT  [a separate net that carries the same name]
NetC176_1: C176.1 L12.1 ; port TX1A.RX_N
NetC176_2: C176.2 T7.6
NetC177_1: C177.1 L11.1 ; port TX1A.RX_P
NetC177_2: C177.2 T7.4
NetC178_2: C178.2 C179.1 L11.2 L12.2
NetC180_1: C180.1 L14.1 ; port TX1B.RX_N
NetC180_2: C180.2 T8.6
NetC181_1: C181.1 L13.1 ; port TX1B.RX_P
NetC181_2: C181.2 T8.4
NetC182_2: C182.2 C183.1 L13.2 L14.2
NetC184_1: C184.1 L16.1 ; port TX2A.RX_N
NetC184_2: C184.2 T9.6
NetC185_1: C185.1 L15.1 ; port TX2A.RX_P
NetC185_2: C185.2 T9.4
NetC186_2: C186.2 C187.1 L15.2 L16.2
NetC188_1: C188.1 L18.1 ; port TX2B.RX_N
NetC188_2: C188.2 T10.6
NetC189_1: C189.1 L17.1 ; port TX2B.RX_P
NetC189_2: C189.2 T10.4
NetC190_2: C190.2 C191.1 L17.2 L18.2
NetP9_1: P9.1(RF) ; sheet U_pa-900/OUT
NetP12_1: P12.1(RF) ; sheet U_pa-900/OUT
NetT8_3: T8.3 U19.6(J1)
NetT10_3: T10.3 U20.6(J1)
NetU19_2: U19.2(RF1) ; sheet U_pa-900/IN
NetU20_2: U20.2(RF1) ; sheet U_pa-900/IN

### Notes on the sheet
- 5 GHz, Channel 1
- 2.4 GHz, Channel 1
- 900 MHz, Channel 1
- 5 GHz, Channel 2
- 2.4 GHz, Channel 2
- 900 MHz, Channel 2
- Title
- Engineer
- Revision
- Drawn By
- Checked By
- Date
- Sheet
- of
- (in symbol SKY13453-385LF) RFC

### Library data of the parts
C176 C177 C180 C181 C184 C185 C188 C189 = CAP 0402: Ceramic Capacitor 20pF ±1% 50V NP0 0402; Manufacturer: Kemet; Tr: -55:125; Voltage: 50V; Manufacturer P/N: CBR04C200F5GAC; Package: 0402; Tolerance: ±1%
C178 C182 C186 C190 = CAP 0603: Ceramic Capacitor 10uF ±20% 25V X5R 0603; Manufacturer: Samsung; Tr: -55:85; Manufacturer P/N: CL10A106MA8NRNC; Voltage: 25V; Package: 0603; Tolerance: ±20%
C179 C183 C187 C191-C193 = VJ0402Y102KXA: Ceramic Capacitor 1nF ±10% 50V X7R 0402; Manufacturer: Vishay; Tr: -55:150; pF: 1000; Manufacturer P/N: VJ0402Y102KXA; Tolerance: ±10%; Package: 0402; Voltage: 50V
L11-L18 = INDUCTOR: Chip Inductor 900nH ±5% 1008; Manufacturer: Coilcraft; Tr: -40:125; Manufacturer P/N: 1008AF-901XJLC; Package: 1008; Tolerance: ±5%
P7-P12 = U.FL-R-SMT(10): as P1007 on sheet cellular; Manufacturer P/N: U.FL-R-SMT(10)
T7-T10 = TCM1-63AX+: RF Transformer 10-6000KHz; Manufacturer: Mini-Circuits; Manufacturer P/N: TC1-1-13M
U19 U20 = SKY13453-385LF: 0.01 MHz-6.0 GHz RF SPDT Switch; Manufacturer: Skyworks; Manufacturer P/N: SKY13453-385LF

## Sheet pa-2g.SchDoc
size Letter; CompanyName: Signal Laboratories, Inc.; Address1: 3479 Edison Way; Address2: Menlo Park CA 94025; Address3: +1 (877) 778-8435; Address4: siglabs.com; Revision: 1; SheetNumber: 1; SheetTotal: 1
Used 2 times, as channels MAIN/U_radio/U_radio-rf/TX/U_pa-2g, MAIN/U_radio/U_radio-rf/TX/U_pa-2g. Parts and nets are listed once, with the designators drawn on the sheet.
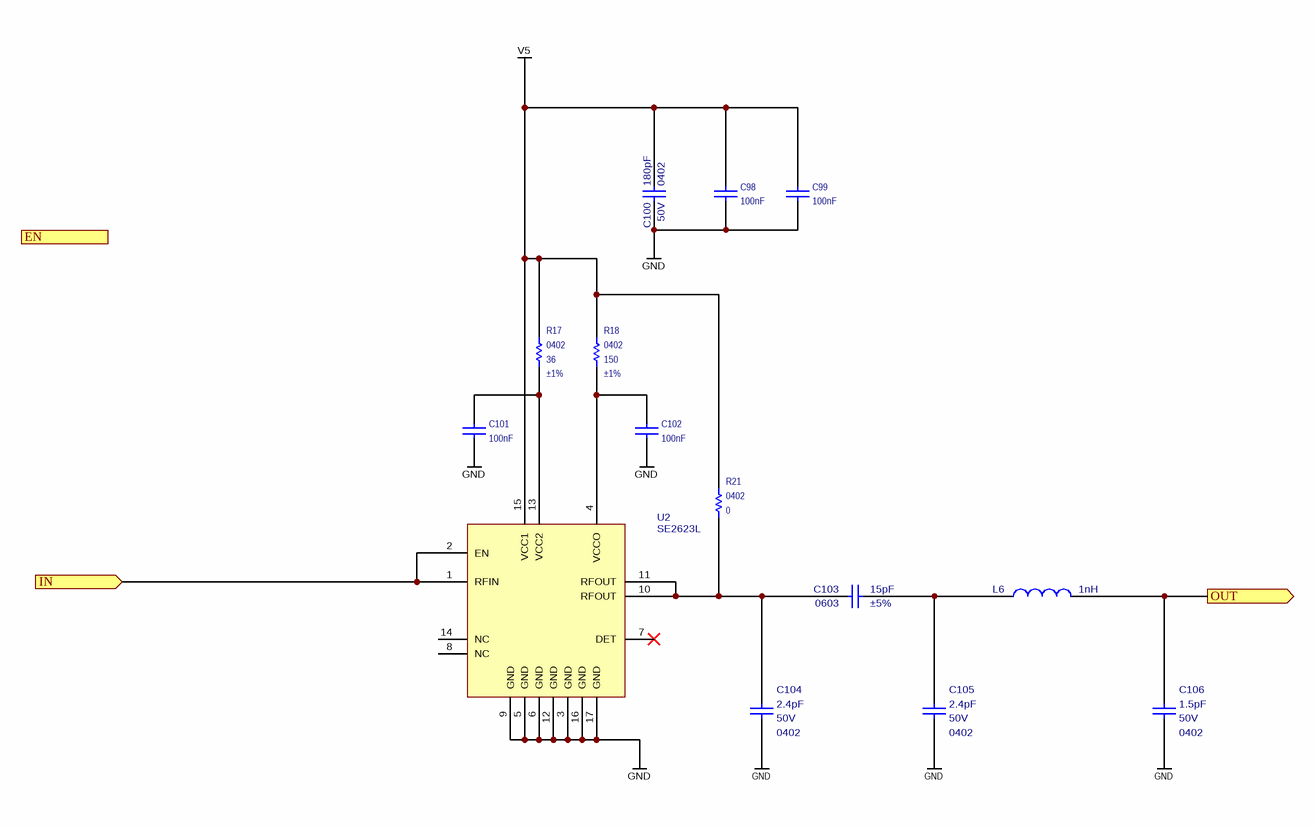
[diagram p45: pa-2g.SchDoc]

### Parts
C98  value 100nF  [CAPC100X50X55L25N]  (hidden comment: GRM155R71C104KA88J)
C99  value 100nF  [CAPC100X50X55L25N]  (hidden comment: GRM155R71C104KA88J)
C100  value 180pF  Package: 0402  Voltage: 50V  [CAPC160X80X90L20N]  (hidden comment: VJ0402A181JNAAJ)
C101  value 100nF  [CAPC100X50X55L25N]  (hidden comment: GRM155R71C104KA88J)
C102  value 100nF  [CAPC100X50X55L25N]  (hidden comment: GRM155R71C104KA88J)
C103  value 15pF  Tolerance: ±5%  Package: 0603  [CAPC160X80X90L20N]  (hidden comment: GQM1885C1H150JB01D)
C104  value 2.4pF  Package: 0402  Voltage: 50V  [CAPC100X50X55L25N]  (hidden comment: VJ0402D2R4BXA)
C105  value 2.4pF  Package: 0402  Voltage: 50V  [CAPC100X50X55L25N]  (hidden comment: VJ0402D2R4BXA)
C106  value 1.5pF  Package: 0402  Voltage: 50V  [CAPC100X50X55L25N]  (hidden comment: VJ0402D1R5BXA)
L6  value 1nH  [INDC1005X55N]  (hidden comment: LQG15HS8N2H02D)
R17  value 36  Tolerance: ±1%  Package: 0402  [RESC1005X40N]  (hidden comment: ERJ-2RKF36R0X)
R18  value 150  Tolerance: ±1%  Package: 0402  [RESC1005X40N]  (hidden comment: ERJ-2RKF1500X)
R21  value 0  Package: 0402  [RESC1005X40N]  (hidden comment: ERJ-2GE0R00X)
U2  SE2623L  [SE2623L]

### Ports
EN (in), IN (in), OUT (out)

### Nets
GND: C98.1 C99.1 C100.1 C101.1 C102.1 C104.2 C105.2 C106.2 U2.3(GND) U2.5(GND) U2.6(GND) U2.9(GND) U2.12(GND) U2.16(GND) U2.17(GND)
V5: C98.2 C99.2 C100.2 R17.2 R18.2 R21.2 U2.15(VCC1)
IN: U2.1(RFIN) U2.2(EN) ; port IN
OUT: C106.1 L6.2 ; port OUT
NetC101_2: C101.2 R17.1 U2.13(VCC2)
NetC102_2: C102.2 R18.1 U2.4(VCCO)
NetC103_1: C103.1 C104.1 R21.1 U2.10(RFOUT) U2.11(RFOUT)
NetC103_2: C103.2 C105.1 L6.1

Not connected (* = marked no-connect by the designer): U2 7(DET)* 8(NC) 14(NC)

### Channels
MAIN/U_radio/U_radio-rf/TX/U_pa-2g: designators end in A; ports EN=EN_U_pa-2g IN=IN OUT=OUT
MAIN/U_radio/U_radio-rf/TX/U_pa-2g: designators end in B; ports EN=EN_U_pa-2g IN=IN OUT=OUT

### Notes on the sheet
- Title
- Engineer
- Revision
- Drawn By
- Checked By
- Date
- Sheet
- of

### Library data of the parts
C98 C99 C101 C102 = CAP 0402: Ceramic Capacitor 100nF ±10% 16V X7R 0402; Manufacturer: Murata; Tr: -55:125; Voltage: 16V; Manufacturer P/N: GRM155R71C104KA88J; Package: 0402; Tolerance: ±10%
C100 = VJ0402A100JXA: Ceramic Capacitor 180pF ±5% 50V C0G 0402; Manufacturer: Vishay; Tr: -55:150; pF: 180; Manufacturer P/N: VJ0402A181JNAAJ; Tolerance: ±5%
C103 = CAP: Ceramic Capacitor 15pF ±5% NP0 0603; Manufacturer: Murata; Voltage: 50V; Tr: -55"125; Manufacturer P/N: GQM1885C1H150JB01D
C104 C105 = VJ0402A2R2BXA: Ceramic Capacitor 2.4pF ±0.1pF 50V C0G 0402; Manufacturer: Vishay; Tr: -55:150; Manufacturer P/N: VJ0402D2R4BXA; Tolerance: ±0.1pF
C106 = VJ0402A2R2BXA: Ceramic Capacitor 1.5pF ±0.1pF 50V C0G 0402; Manufacturer: Vishay; Tr: -55:150; Manufacturer P/N: VJ0402D1R5BXA; Tolerance: ±0.1pF
L6 = INDUCTOR: Inductor 1nH ±0.3nH 1A; Manufacturer P/N: LQG15HS1N0S02D; Manufacturer: Murata
R17 = RES: Thin Film Resistor 36 +/-1% SMD 0402; Manufacturer: Panasoinc; Tr: -55:155; Power: 0.063W; Tcr: *; Manufacturer P/N: ERJ-2RKF36R0X; Alternatives: *; Voltage: *
R18 = RES: Thin Film Resistor 150 +/-1% SMD 0402; Manufacturer: Panasoinc; Tr: -55:155; Power: 0.063W; Tcr: *; Manufacturer P/N: ERJ-2RKF1500X; Alternatives: *; Voltage: *
R21 = RES: Thin Film Resistor 0 +/-1% SMD 0402; Manufacturer: Panasoinc; Tr: -55:155; Power: 0.063W; Tcr: *; Manufacturer P/N: ERJ-2GE0R00X; Alternatives: *; Voltage: *
U2 = SE2623L: 2.4 GHz, 33dB Power Amplifier

## Sheet pa-5g.SchDoc
size Letter; CompanyName: Signal Laboratories, Inc.; Address1: 3479 Edison Way; Address2: Menlo Park CA 94025; Address3: +1 (877) 778-8435; Address4: siglabs.com; Revision: 1; SheetNumber: 1; SheetTotal: 1
Used 2 times, as channels MAIN/U_radio/U_radio-rf/TX/U_pa-5g, MAIN/U_radio/U_radio-rf/TX/U_pa-5g. Parts and nets are listed once, with the designators drawn on the sheet.
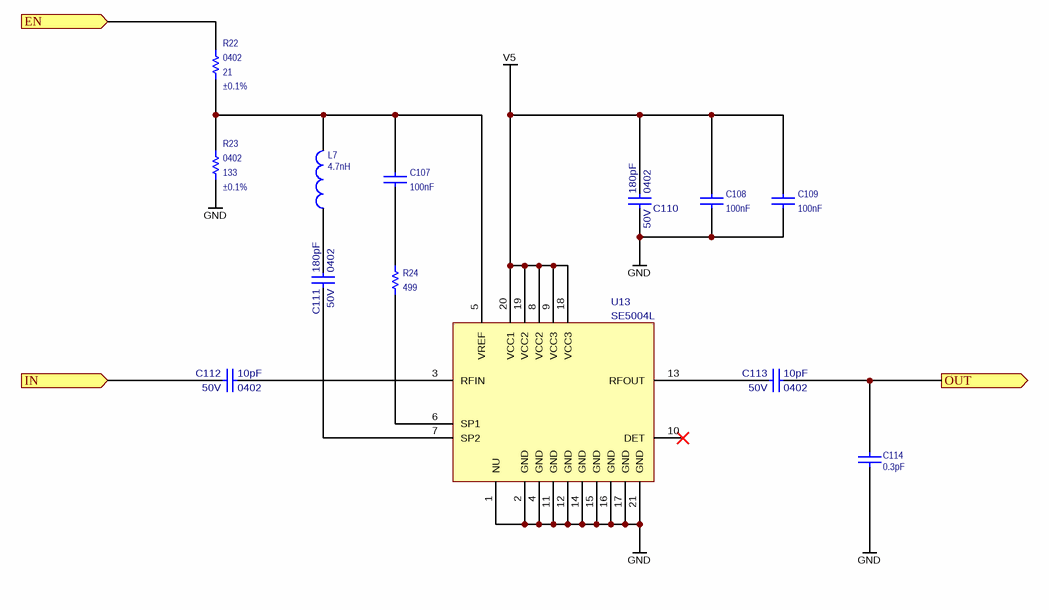
[diagram p46: pa-5g.SchDoc]

### Parts
C107  value 100nF  [CAPC100X50X55L25N]  (hidden comment: GRM155R71C104KA88J)
C108  value 100nF  [CAPC100X50X55L25N]  (hidden comment: GRM155R71C104KA88J)
C109  value 100nF  [CAPC100X50X55L25N]  (hidden comment: GRM155R71C104KA88J)
C110  value 180pF  Package: 0402  Voltage: 50V  [CAPC160X80X90L20N]  (hidden comment: VJ0402A181JNAAJ)
C111  value 180pF  Package: 0402  Voltage: 50V  [CAPC160X80X90L20N]  (hidden comment: VJ0402A181JNAAJ)
C112  value 10pF  Package: 0402  Voltage: 50V  [CAPC160X80X90L20N]  (hidden comment: VJ0402A100JXA)
C113  value 10pF  Package: 0402  Voltage: 50V  [CAPC160X80X90L20N]  (hidden comment: VJ0402A100JXA)
C114  value 0.3pF  [0402]  (hidden comment: CBR04C200F5GAC)
L7  value 4.7nH  [0402]  (hidden comment: LQW15AN4N7C00D)
R22  value 21  Tolerance: ±0.1%  Package: 0402  [RESC1005X40N]  (hidden comment: ERJ-2RKF21R0X)
R23  value 133  Tolerance: ±0.1%  Package: 0402  [RESC1005X40N]  (hidden comment: ERA-2AEB1330X)
R24  value 499  [RESC1005X40N]  (hidden comment: MCS0402PD4990DE500)
U13  SE5004L  [SE5004L]

### Ports
EN (in), IN (in), OUT (out)

### Nets
GND: C108.1 C109.1 C110.1 C114.1 R23.1 U13.1(NU) U13.2(GND) U13.4(GND) U13.11(GND) U13.12(GND) U13.14(GND) U13.15(GND) U13.16(GND) U13.17(GND) U13.21(GND)
V5: C108.2 C109.2 C110.2 U13.8(VCC2) U13.9(VCC3) U13.18(VCC3) U13.19(VCC2) U13.20(VCC1)
EN: R22.2 ; port EN
IN: C112.1 ; port IN
OUT: C113.2 C114.2 ; port OUT
NetC107_1: C107.1 R24.2
NetC107_2: C107.2 L7.2 R22.1 R23.2 U13.5(VREF)
NetC111_1: C111.1 U13.7(SP2)
NetC111_2: C111.2 L7.1
NetC112_2: C112.2 U13.3(RFIN)
NetC113_1: C113.1 U13.13(RFOUT)
NetR24_1: R24.1 U13.6(SP1)

Not connected (* = marked no-connect by the designer): U13 10(DET)*

### Channels
MAIN/U_radio/U_radio-rf/TX/U_pa-5g: designators end in A; ports EN=EN_U_pa-5g IN=IN OUT=OUT
MAIN/U_radio/U_radio-rf/TX/U_pa-5g: designators end in B; ports EN=EN_U_pa-5g IN=IN OUT=OUT

### Notes on the sheet
- Title
- Engineer
- Revision
- Drawn By
- Checked By
- Date
- Sheet
- of

### Library data of the parts
C107-C109 = CAP 0402: as C98 on sheet pa-2g; Voltage: 16V; Manufacturer P/N: GRM155R71C104KA88J; Package: 0402; Tolerance: ±10%
C110 C111 = VJ0402A100JXA: as C100 on sheet pa-2g; Manufacturer P/N: VJ0402A181JNAAJ; Tolerance: ±5%
C112 C113 = VJ0402A100JXA: Ceramic Capacitor 10pF ±5% 50V C0G 0402; Manufacturer: Vishay; Tr: -55:150; pF: 10; Manufacturer P/N: VJ0402A100JXA; Tolerance: ±5%
C114 = CAP 0402: Ceramic Capacitor 20pF ±1% 50V NP0 0402; Manufacturer: Kemet; Manufacturer P/N: CBR04C308B5GAC; Tr: -55:125; Voltage: 50V; Package: 0402; Tolerance: ±1%
L7 = INDUCTOR: Inductor Wirewound 4.7nH ±0.2nH 0402; Manufacturer: Murata; Tr: -55:125; Manufacturer P/N: LQW15AN4N7C00D; Package: 0402; Tolerance: ±0.2nH
R22 = RES: Thin Film Resistor 21 +/-0.1% SMD 0402; Manufacturer: Panasoinc; Tr: -55:155; Power: 0.063W; Tcr: *; Manufacturer P/N: ERJ-2RKF21R0X; Alternatives: *; Voltage: *
R23 = RES: Thin Film Resistor 133 +/-0.1% SMD 0402; Manufacturer: Panasoinc; Tr: -55:155; Power: 0.063W; Tcr: *; Manufacturer P/N: ERA-2AEB1330X; Alternatives: *; Voltage: *
R24 = RES 0603: Thin Film Resistor 499 Ohm ±0.5% 0402; Manufacturer: Vishay; Tr: -55:175; Package: 0402; Manufacturer P/N: MCS0402PD4990DE500; Do Not Place: *; Tolerance: ±0.5%
U13 = SE5004L: 5 GHz, 26dBm Power Amplifier

## Sheet rx.SchDoc
size Letter; CompanyName: Signal Laboratories, Inc.; Address1: 3479 Edison Way; Address2: Menlo Park CA 94025; Address3: +1 (877) 778-8435; Address4: siglabs.com; Revision: 1; SheetNumber: 1; SheetTotal: 1
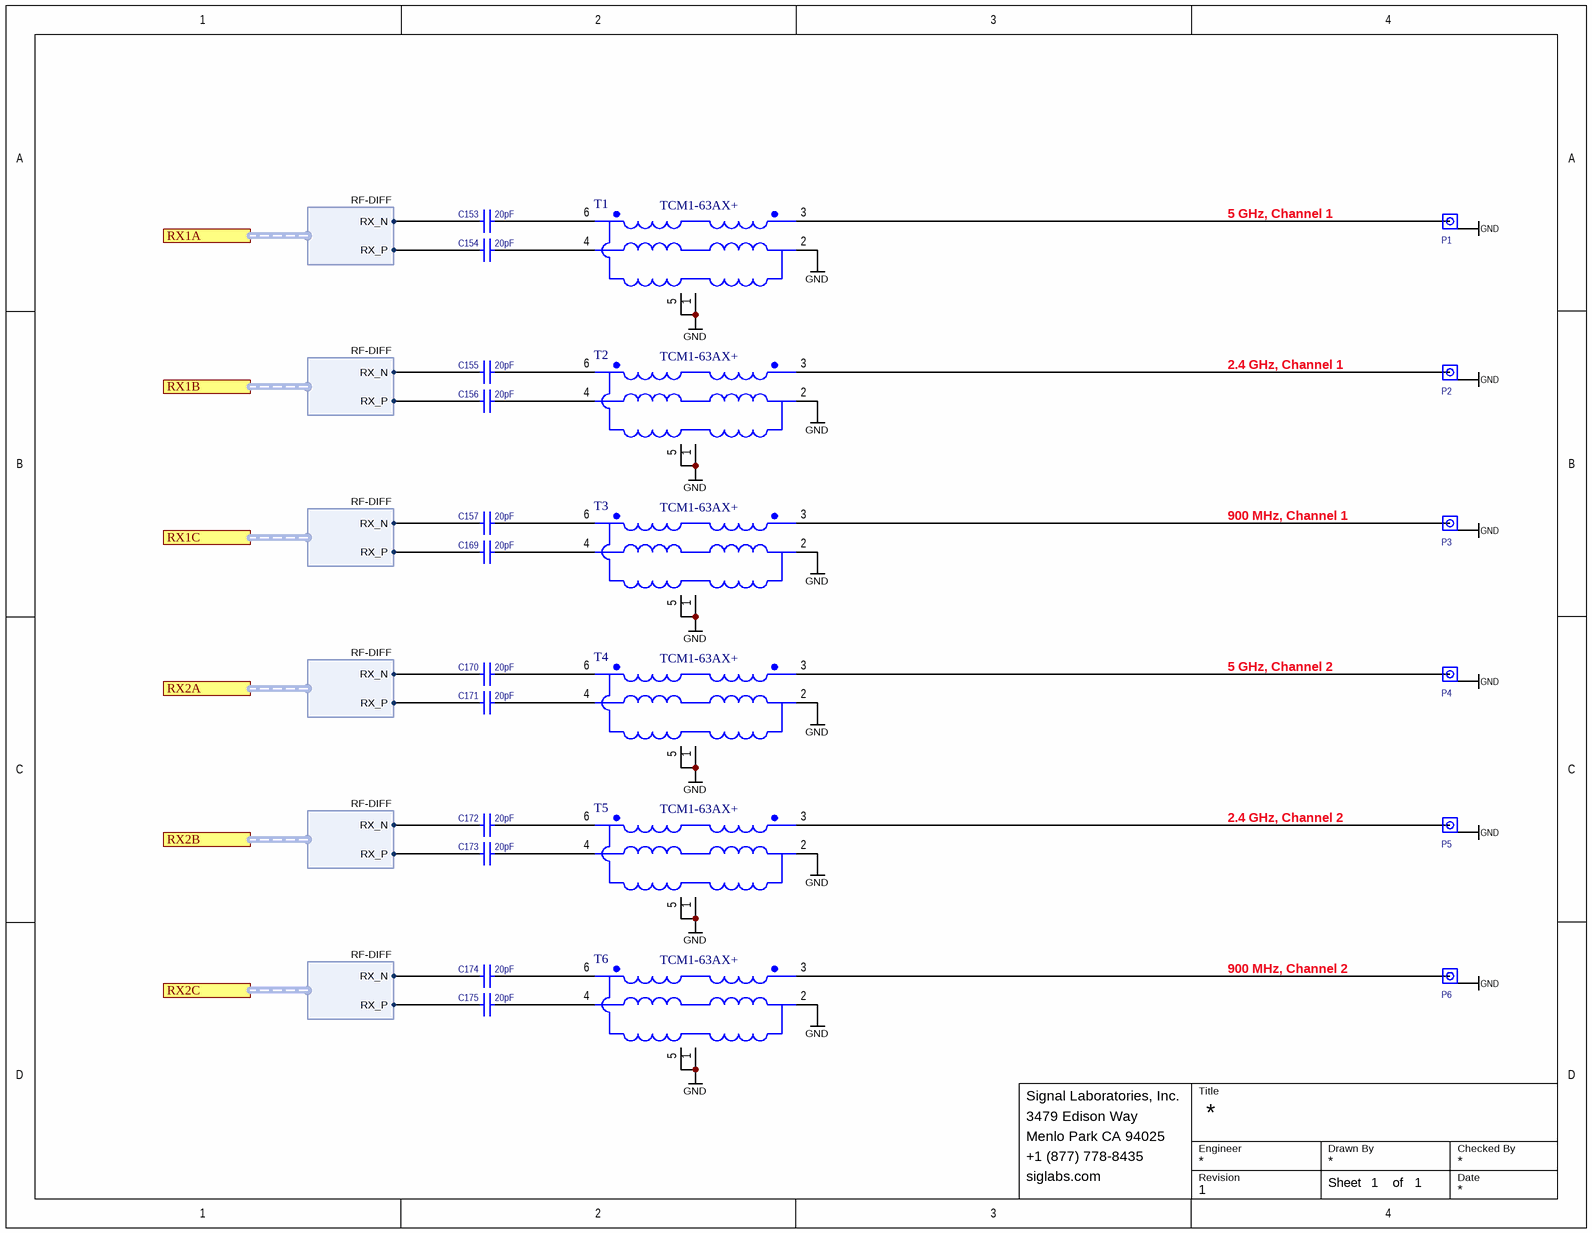
[diagram p47: rx.SchDoc]

### Parts
C153  value 20pF  [0402]  (hidden comment: CBR04C200F5GAC)
C154  value 20pF  [0402]  (hidden comment: CBR04C200F5GAC)
C155  value 20pF  [0402]  (hidden comment: CBR04C200F5GAC)
C156  value 20pF  [0402]  (hidden comment: CBR04C200F5GAC)
C157  value 20pF  [0402]  (hidden comment: CBR04C200F5GAC)
C169  value 20pF  [0402]  (hidden comment: CBR04C200F5GAC)
C170  value 20pF  [0402]  (hidden comment: CBR04C200F5GAC)
C171  value 20pF  [0402]  (hidden comment: CBR04C200F5GAC)
C172  value 20pF  [0402]  (hidden comment: CBR04C200F5GAC)
C173  value 20pF  [0402]  (hidden comment: CBR04C200F5GAC)
C174  value 20pF  [0402]  (hidden comment: CBR04C200F5GAC)
C175  value 20pF  [0402]  (hidden comment: CBR04C200F5GAC)
P1  U.FL-R-SMT(10)  [U.FL-R-SMT(10)]  (value not drawn)
P2  U.FL-R-SMT(10)  [U.FL-R-SMT(10)]  (value not drawn)
P3  U.FL-R-SMT(10)  [U.FL-R-SMT(10)]  (value not drawn)
P4  U.FL-R-SMT(10)  [U.FL-R-SMT(10)]  (value not drawn)
P5  U.FL-R-SMT(10)  [U.FL-R-SMT(10)]  (value not drawn)
P6  U.FL-R-SMT(10)  [U.FL-R-SMT(10)]  (value not drawn)
T1  TCM1-63AX+  [TCM1-63AX+]
T2  TCM1-63AX+  [TCM1-63AX+]
T3  TCM1-63AX+  [TCM1-63AX+]
T4  TCM1-63AX+  [TCM1-63AX+]
T5  TCM1-63AX+  [TCM1-63AX+]
T6  TCM1-63AX+  [TCM1-63AX+]

### Ports
RX1A (harness RF-DIFF), RX1B (harness RF-DIFF), RX1C (harness RF-DIFF), RX2A (harness RF-DIFF), RX2B (harness RF-DIFF), RX2C (harness RF-DIFF)

### Harnesses
RF-DIFF: RX_N, RX_P

### Nets
GND: P1.2(GND) P2.2(GND) P3.2(GND) P4.2(GND) P5.2(GND) P6.2(GND) T1.1 T1.2 T1.5 T2.1 T2.2 T2.5 T3.1 T3.2 T3.5 T4.1 T4.2 T4.5 T5.1 T5.2 T5.5 T6.1 T6.2 T6.5
NetC153_1: C153.1 ; port RX1A.RX_N
NetC153_2: C153.2 T1.6
NetC154_1: C154.1 ; port RX1A.RX_P
NetC154_2: C154.2 T1.4
NetC155_1: C155.1 ; port RX1B.RX_N
NetC155_2: C155.2 T2.6
NetC156_1: C156.1 ; port RX1B.RX_P
NetC156_2: C156.2 T2.4
NetC157_1: C157.1 ; port RX1C.RX_N
NetC157_2: C157.2 T3.6
NetC169_1: C169.1 ; port RX1C.RX_P
NetC169_2: C169.2 T3.4
NetC170_1: C170.1 ; port RX2A.RX_N
NetC170_2: C170.2 T4.6
NetC171_1: C171.1 ; port RX2A.RX_P
NetC171_2: C171.2 T4.4
NetC172_1: C172.1 ; port RX2B.RX_N
NetC172_2: C172.2 T5.6
NetC173_1: C173.1 ; port RX2B.RX_P
NetC173_2: C173.2 T5.4
NetC174_1: C174.1 ; port RX2C.RX_N
NetC174_2: C174.2 T6.6
NetC175_1: C175.1 ; port RX2C.RX_P
NetC175_2: C175.2 T6.4
NetP1_1: P1.1(RF) T1.3
NetP2_1: P2.1(RF) T2.3
NetP3_1: P3.1(RF) T3.3
NetP4_1: P4.1(RF) T4.3
NetP5_1: P5.1(RF) T5.3
NetP6_1: P6.1(RF) T6.3

### Notes on the sheet
- 5 GHz, Channel 1
- 2.4 GHz, Channel 1
- 900 MHz, Channel 1
- 5 GHz, Channel 2
- 2.4 GHz, Channel 2
- 900 MHz, Channel 2
- Title
- Engineer
- Revision
- Drawn By
- Checked By
- Date
- Sheet
- of

### Library data of the parts
C153-C157 C169-C175 = CAP 0402: as C176 on sheet tx; Voltage: 50V; Manufacturer P/N: CBR04C200F5GAC; Package: 0402; Tolerance: ±1%
P1-P6 = U.FL-R-SMT(10): as P1007 on sheet cellular; Manufacturer P/N: U.FL-R-SMT(10)
T1-T6 = TCM1-63AX+: as T7 on sheet tx

## Sheet mechanical.SchDoc: CS - Mechanical
size Letter; CheckedBy: J. Brinton; CompanyName: Signal Laboratories, Inc.; DrawnBy: J. Brinton; Engineer: J. Brinton; Address1: 3479 Edison Way; Address2: Menlo Park CA 94025; Address3: +1 (877) 778-8435; Address4: siglabs.com; Revision: 3; SheetNumber: 47; SheetTotal: 47
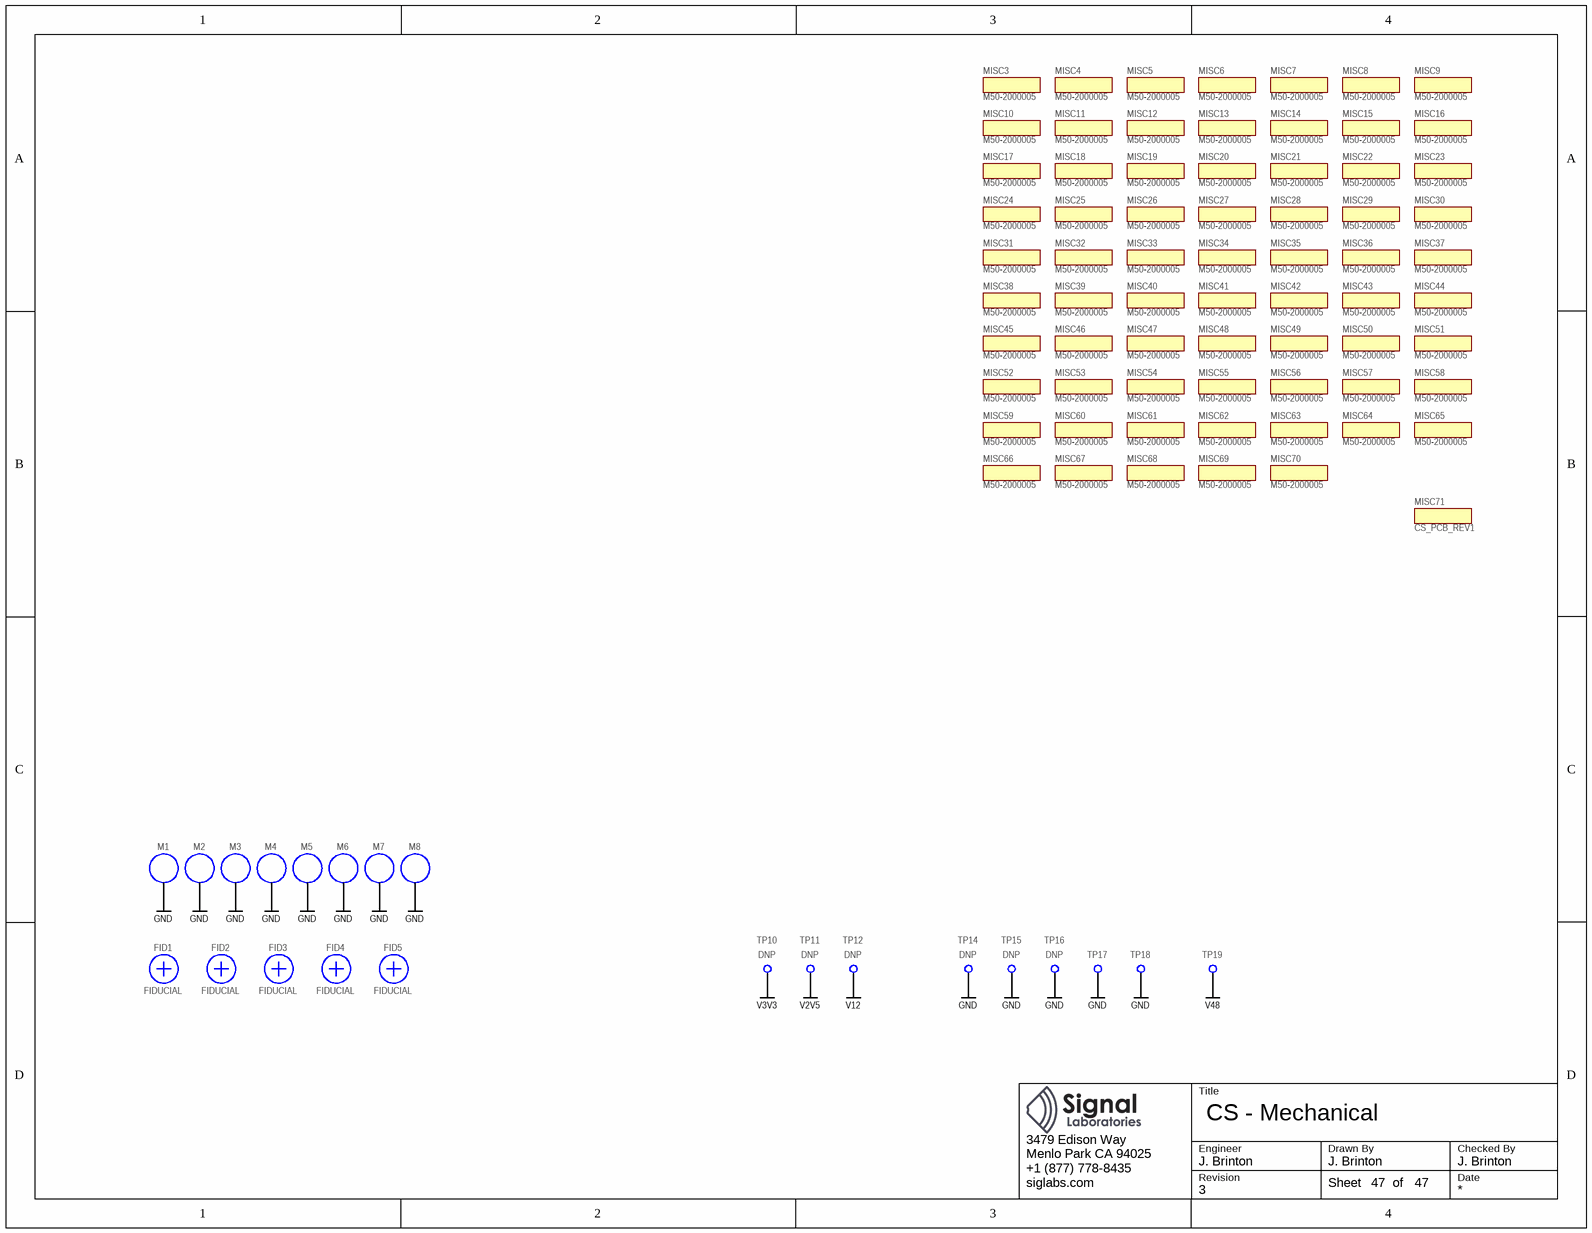
[diagram p48: mechanical.SchDoc]

### Parts
FID1  FIDUCIAL  [FIDUCIAL]  (no BOM)
FID2  FIDUCIAL  [FIDUCIAL]  (no BOM)
FID3  FIDUCIAL  [FIDUCIAL]  (no BOM)
FID4  FIDUCIAL  [FIDUCIAL]  (no BOM)
FID5  FIDUCIAL  [FIDUCIAL]  (no BOM)
M1  MOUNT  [MOUNTM3]  (value not drawn)  (no BOM)
M2  MOUNT  [MOUNTM3]  (value not drawn)  (no BOM)
M3  MOUNT  [MOUNTM3]  (value not drawn)  (no BOM)
M4  MOUNT  [MOUNTM3]  (value not drawn)  (no BOM)
M5  MOUNT  [MOUNTM3]  (value not drawn)  (no BOM)
M6  MOUNT  [MOUNTM3]  (value not drawn)  (no BOM)
M7  MOUNT  [MOUNTM3]  (value not drawn)  (no BOM)
M8  MOUNT  [MOUNTM3]  (value not drawn)  (no BOM)
MISC3  M50-2000005  (mechanical)
MISC4  M50-2000005  (mechanical)
MISC5  M50-2000005  (mechanical)
MISC6  M50-2000005  (mechanical)
MISC7  M50-2000005  (mechanical)
MISC8  M50-2000005  (mechanical)
MISC9  M50-2000005  (mechanical)
MISC10  M50-2000005  (mechanical)
MISC11  M50-2000005  (mechanical)
MISC12  M50-2000005  (mechanical)
MISC13  M50-2000005  (mechanical)
MISC14  M50-2000005  (mechanical)
MISC15  M50-2000005  (mechanical)
MISC16  M50-2000005  (mechanical)
MISC17  M50-2000005  (mechanical)
MISC18  M50-2000005  (mechanical)
MISC19  M50-2000005  (mechanical)
MISC20  M50-2000005  (mechanical)
MISC21  M50-2000005  (mechanical)
MISC22  M50-2000005  (mechanical)
MISC23  M50-2000005  (mechanical)
MISC24  M50-2000005  (mechanical)
MISC25  M50-2000005  (mechanical)
MISC26  M50-2000005  (mechanical)
MISC27  M50-2000005  (mechanical)
MISC28  M50-2000005  (mechanical)
MISC29  M50-2000005  (mechanical)
MISC30  M50-2000005  (mechanical)
MISC31  M50-2000005  (mechanical)
MISC32  M50-2000005  (mechanical)
MISC33  M50-2000005  (mechanical)
MISC34  M50-2000005  (mechanical)
MISC35  M50-2000005  (mechanical)
MISC36  M50-2000005  (mechanical)
MISC37  M50-2000005  (mechanical)
MISC38  M50-2000005  (mechanical)
MISC39  M50-2000005  (mechanical)
MISC40  M50-2000005  (mechanical)
MISC41  M50-2000005  (mechanical)
MISC42  M50-2000005  (mechanical)
MISC43  M50-2000005  (mechanical)
MISC44  M50-2000005  (mechanical)
MISC45  M50-2000005  (mechanical)
MISC46  M50-2000005  (mechanical)
MISC47  M50-2000005  (mechanical)
MISC48  M50-2000005  (mechanical)
MISC49  M50-2000005  (mechanical)
MISC50  M50-2000005  (mechanical)
MISC51  M50-2000005  (mechanical)
MISC52  M50-2000005  (mechanical)
MISC53  M50-2000005  (mechanical)
MISC54  M50-2000005  (mechanical)
MISC55  M50-2000005  (mechanical)
MISC56  M50-2000005  (mechanical)
MISC57  M50-2000005  (mechanical)
MISC58  M50-2000005  (mechanical)
MISC59  M50-2000005  (mechanical)
MISC60  M50-2000005  (mechanical)
MISC61  M50-2000005  (mechanical)
MISC62  M50-2000005  (mechanical)
MISC63  M50-2000005  (mechanical)
MISC64  M50-2000005  (mechanical)
MISC65  M50-2000005  (mechanical)
MISC66  M50-2000005  (mechanical)
MISC67  M50-2000005  (mechanical)
MISC68  M50-2000005  (mechanical)
MISC69  M50-2000005  (mechanical)
MISC70  M50-2000005  (mechanical)
MISC71  CS_PCB_REV1  (mechanical)
TP10  Do Not Place: DNP  [TEST_POINT]  (hidden comment: 5000)
TP11  Do Not Place: DNP  [TEST_POINT]  (hidden comment: 5000)
TP12  Do Not Place: DNP  [TEST_POINT]  (hidden comment: 5000)
TP14  Do Not Place: DNP  [TEST_POINT]  (hidden comment: 5000)
TP15  Do Not Place: DNP  [TEST_POINT]  (hidden comment: 5000)
TP16  Do Not Place: DNP  [TEST_POINT]  (hidden comment: 5000)
TP17  5000  [TEST_POINT]  (value not drawn)
TP18  5000  [TEST_POINT]  (value not drawn)
TP19  5000  [TEST_POINT]  (value not drawn)

### Nets
GND: M1.1(MNT) M2.1(MNT) M3.1(MNT) M4.1(MNT) M5.1(MNT) M6.1(MNT) M7.1(MNT) M8.1(MNT) TP14.1 TP15.1 TP16.1 TP17.1 TP18.1
V2V5: TP11.1
V3V3: TP10.1
V12: TP12.1
V48: TP19.1

### Notes on the sheet
- Title
- Engineer
- Revision
- Drawn By
- Checked By
- Date
- Sheet
- of

### Library data of the parts
M1-M8 = MOUNT: M3 Standard Fit Hole; Manufacturer: *; Manufacturer P/N: *
MISC3-MISC70 = M50-1900005: 1.27mm Jumper Socket; Manufacturer: Harwin; Do Not Place: PURCHASE BUT DNP; Manufacturer P/N: M50-2000005
MISC71 = M50-1900005: Copper Suicide PCB; Manufacturer: Signal Laboratories, Inc.; Manufacturer P/N: CS_PCB_REV1
TP10-TP12 TP14-TP19 = TEST_POINT: Thruhole Miniature Test Point; Manufacturer: Keystone Electronics Corp; Manufacturer P/N: 5000
  TP17-TP19: Do Not Place: *